# EAGLE design NixiePSU (EAGLE 7.7.0)
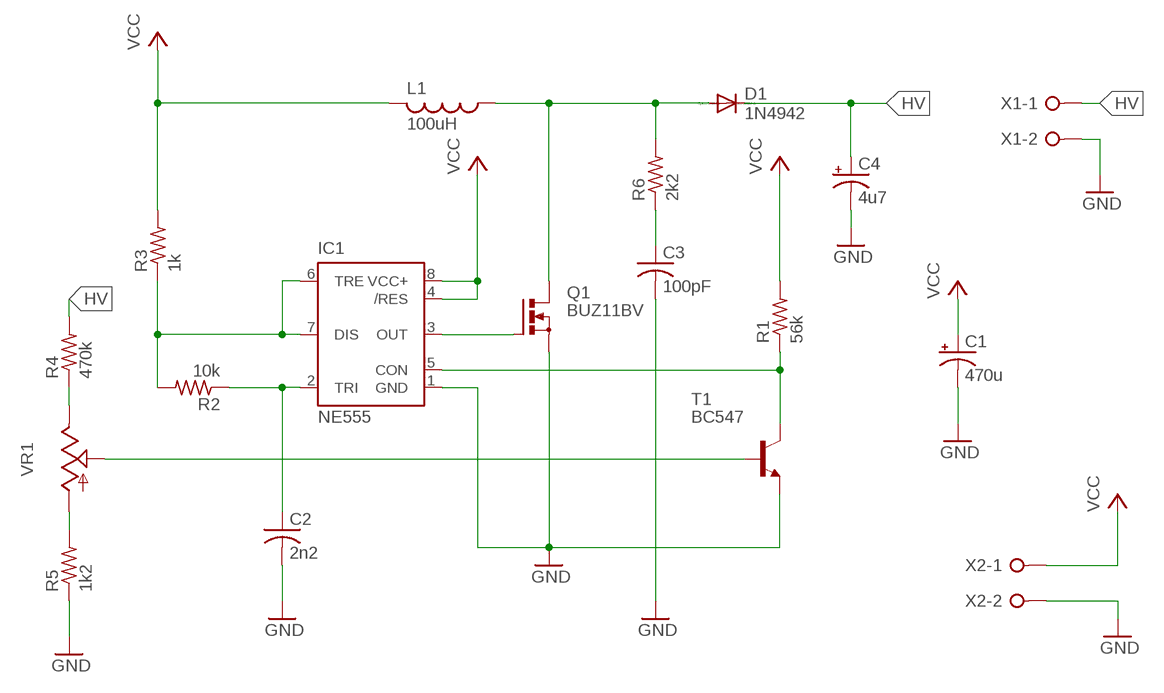
[diagram p0: schematic, sheet 1]

## Parts
C1  470u  CPOL-USE5-13  [E5-13]
C2  2n2  C-US050-025X075  [C050-025X075]
C3  100pF  C-US050-025X075  [C050-025X075]
C4  4u7  CPOL-USE3.5-8  [E3,5-8]
D1  1N4942  [DO41-10]
IC1  NE555  [DIL-08]
L1  100uH  L-US  [RLB0914]
Q1  BUZ11BV  [TO220BV]
R1  56k  R-US_0207/10  [0207/10]
R2  10k  R-US_0207/10  [0207/10]
R3  1k  R-US_0207/10  [0207/10]
R4  470k  R-US_0207/10  [0207/10]
R5  1k2  R-US_0207/10  [0207/10]
R6  2k2  R-US_0207/10  [0207/10]
T1  BC547  [TO92]
VR1  TRIM_US-B25P  [B25P]
X1  W237-02P  [W237-132]
X2  W237-02P  [W237-132]

## Nets
GND: C1.- C2.2 C3.2 C4.- IC1.1(GND) Q1.S R5.1 T1.1(E) X1.2 X2.2
HV: C4.+ D1.C R4.2 X1.1
N$1: IC1.3(OUT) Q1.G
N$2: D1.A L1.1 Q1.D R6.2
N$3: IC1.6(TRE) IC1.7(DIS) R2.2 R3.1
N$4: R4.1 VR1.E
N$6: IC1.5(CON) R1.1 T1.3(C)
N$7: R5.2 VR1.A
N$8: T1.2(B) VR1.S
N$9: C3.1 R6.1
N$10: C2.1 IC1.2(TRI) R2.1
VCC: C1.+ IC1.4(/RES) IC1.8(VCC+) L1.2 R1.2 R3.2 X2.1

## Library data of the parts
C1 C4 = rcl:CPOL-US: POLARIZED CAPACITOR, American symbol
C2 C3 = rcl:C-US: CAPACITOR, American symbol
D1 = diode:1N4942: DIODE 1.0 A, 200 V, 150 ns
IC1 = st-microelectronics:NE555: General purpose bipolar Timer; MF: Arrow Electronics; MPN: NE555N; OC_FARNELL: 1467742; OC_NEWARK: 89K1486
L1 = Inductors:L-US: INDUCTOR, American symbol
Q1 = transistor-power:BUZ11: N-CHANNEL MOS FET
R1-R6 = rcl:R-US_: RESISTOR, American symbol
T1 = transistor:BC547: NPN TRANSISTOR
VR1 = pot:TRIM_US-: POTENTIOMETER
X1 X2 = con-wago-508:W237-02P: WAGO SREW CLAMP; OC_FARNELL: unknown; OC_NEWARK: unknown

## Board
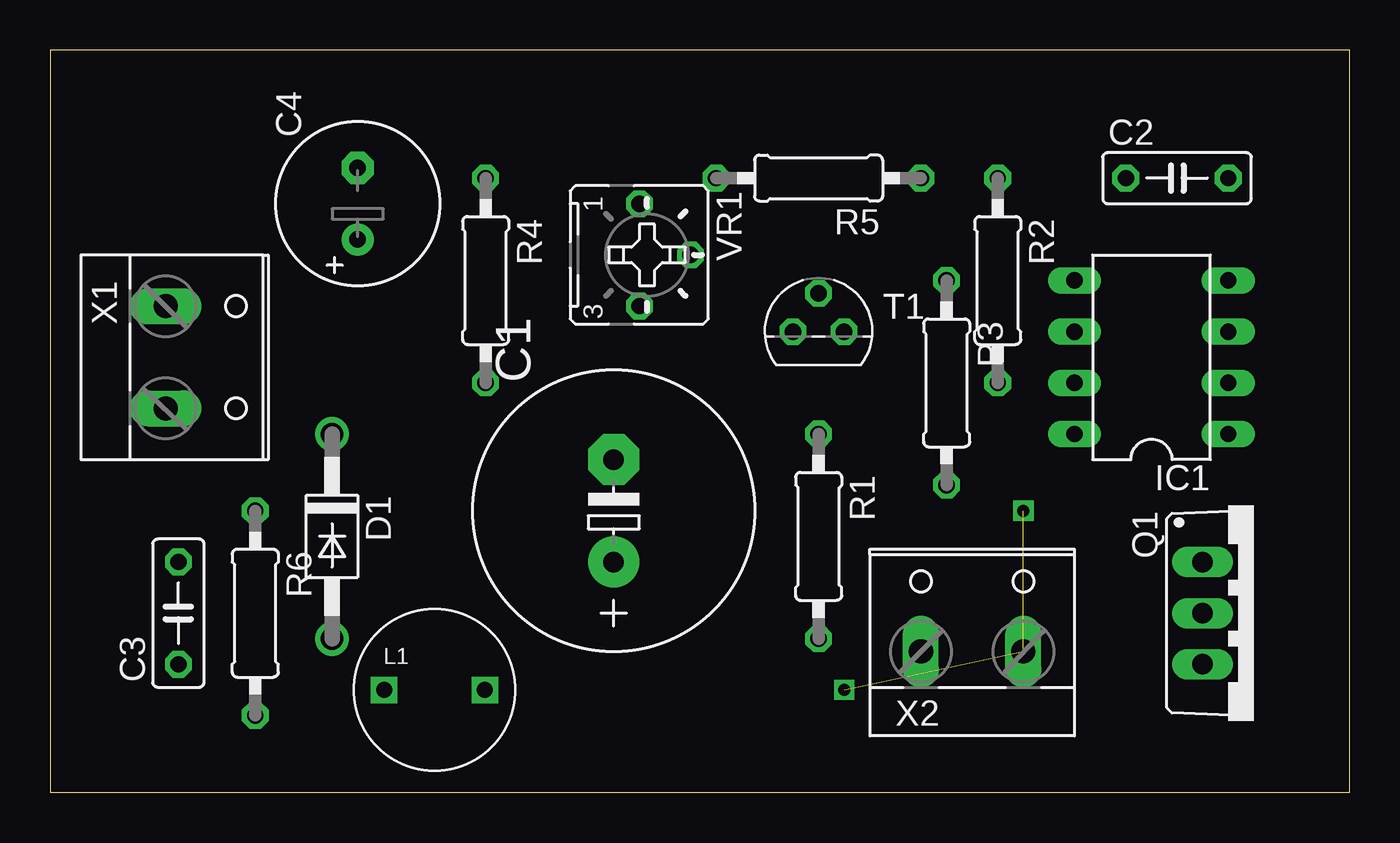
[diagram p1: board, top side]
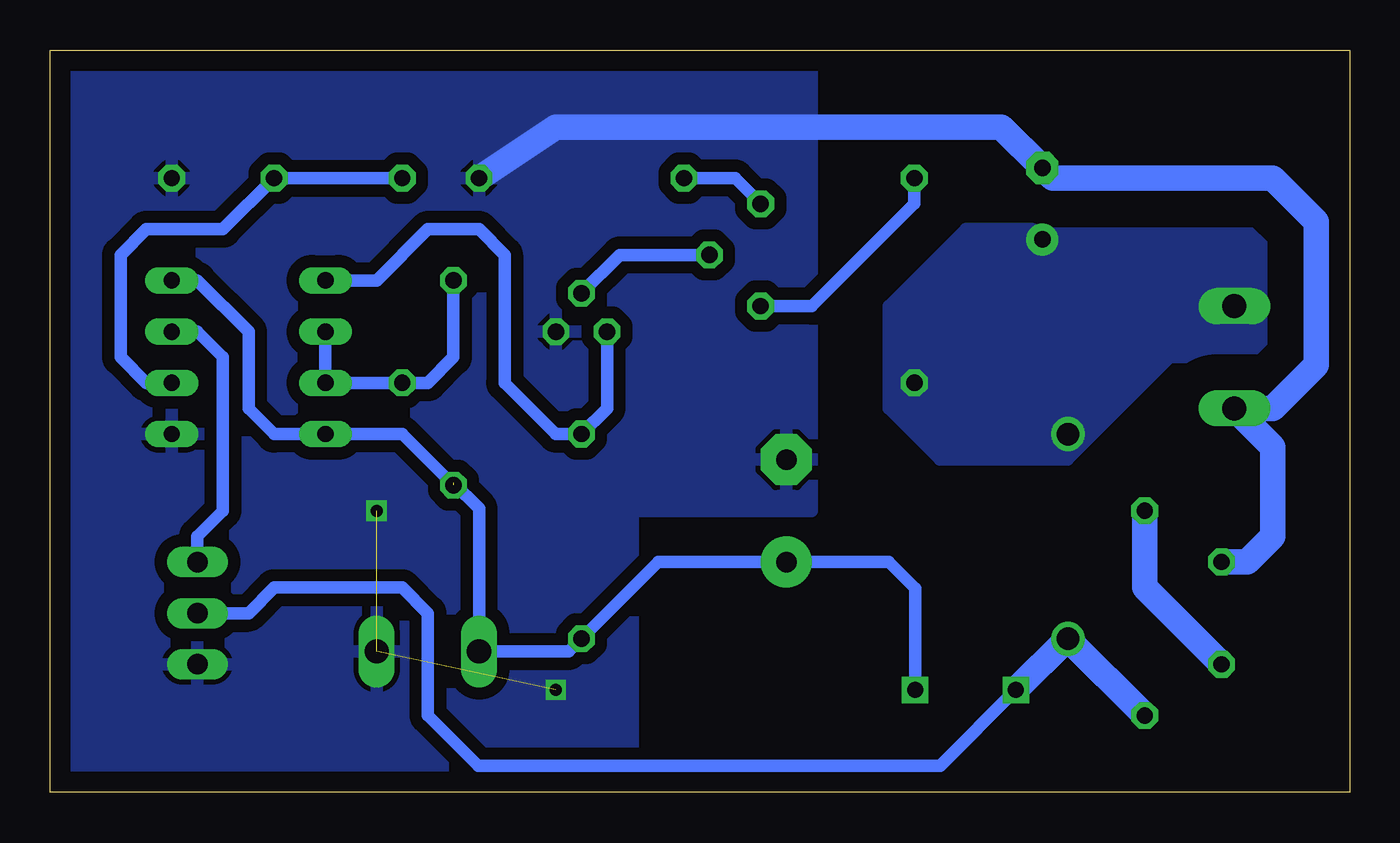
[diagram p2: board, bottom side, seen from below]

Size 64.44 x 36.82 mm. Coordinates in mm from the lower left corner, seen from the top.
Outline: 0,0 64.44,0 64.44,36.82 0,36.82 0,0
Copper layers (1*16): Top 0.035mm / dielectric 1.5mm / Bottom 0.035mm
Design rules "default": minimum track width 10mil, minimum drill 24mil, track to track 8mil, track to pad 8mil, pad to pad 8mil, via to via 8mil, smd to smd 8mil, copper to edge 40mil, drill to drill 8mil, minimum pad ring 10mil, minimum via ring 8mil, stop-mask expansion 4mil, vias tented up to drill 0mil, thermal gap 10mil

### Footprints (pad centres in the part's own frame; a part is rotated, then mirrored left to right if it is on the bottom)
E5-13 = drill 1.016 pad 2.54: + -2.54,0 | drill 1.016 pad 2.54 octagon: - 2.54,0
C050-025X075 = drill 0.813 octagon: 1 -2.54,0; 2 2.54,0
E3,5-8 = drill 0.813 pad 1.6: + -1.778,0 | drill 0.813 pad 1.6 octagon: - 1.778,0
DO41-10 = drill 1.118: A 5.08,0; C -5.08,0
DIL-08 = drill 0.813 long: 1 -3.81,-3.81; 2 -1.27,-3.81; 3 1.27,-3.81; 4 3.81,-3.81; 5 3.81,3.81; 6 1.27,3.81; 7 -1.27,3.81; 8 -3.81,3.81
RLB0914 = drill 0.8 square: 1 -2.5,0; 2 2.5,0
TO220BV = drill 1.016 long: D 0,-2.54; G -2.54,-2.54; S 2.54,-2.54
0207/10 = drill 0.813 octagon: 1 -5.08,0; 2 5.08,0
TO92 = drill 0.813 octagon: 1 1.27,0; 2 0,1.905; 3 -1.27,0
B25P = drill 0.813 octagon: A -2.54,0; E 2.54,0; S 0,2.54
W237-132 = drill 1.194 long: 1 -2.54,-0.635; 2 2.54,-0.635

### Placement (x,y rotation side)
C1  27.94,13.97 90 top
C2  55.88,30.48 0 top
C3  6.35,8.89 90 top
C4  15.24,29.21 90 top
D1  13.97,12.7 270 top
IC1  54.61,21.59 90 top
L1  19.05,5.08 0 top
Q1  59.69,8.89 270 top
R1  38.1,12.7 270 top
R2  46.99,25.4 270 top
R3  44.45,20.32 270 top
R4  21.59,25.4 270 top
R5  38.1,30.48 180 top
R6  10.16,8.89 270 top
T1  38.1,22.86 0 top
VR1  29.21,26.67 270 top
X1  6.35,21.59 270 top
X2  45.72,7.62 0 top

### Tracks (layer width: path | path; a pad name or v marks a point on that pad's centre or on a via)
GND  (via drill 0.6)  (2 unrouted)
  Bottom 1.27: R5.1 39.37,33.02 17.27,33.02 C4.- 14.73,30.48 3.81,30.48 1.65,28.32 1.65,21.21 3.81,19.05 X1.2 3.81,17.14 3.81,12.7 5.08,11.43 C3.2
  other vias: 48.26,13.97 39.37,5.08
  pour Bottom (isolate 0.61): 26.67,39.37 66.04,39.37 66.04,-2.54 35.56,-2.54 35.56,13.97 26.67,13.97
HV
  pour Bottom (isolate 1.778, no thermals): 3.81,21.59 3.81,26.67 5.08,27.94 19.05,27.94 22.86,24.13 22.86,19.05 20.32,16.51 13.97,16.51 8.89,21.59
N$1
  Bottom 0.61: IC1.3 57.15,22.86 55.88,21.59 55.88,13.97 57.15,12.7 Q1.G
N$2
  Bottom 0.61: Q1.D 54.61,8.89 53.34,10.16 46.99,10.16 45.72,8.89 45.72,3.81 43.23,1.32 20.31,1.32 L1.1
  Bottom 1.27: R6.2 D1.A 14.01,7.62 L1.1
N$3
  Bottom 0.61: R3.1 44.45,21.59 45.72,20.32 R2.2 50.72,20.32 | 50.72,20.32 IC1.7 | IC1.6 50.8,20.4 50.72,20.32
N$4
  Bottom 0.61: VR1.E 26.67,24.13 21.59,29.21 R4.1
N$6
  Bottom 0.61: T1.3 36.83,19.05 R1.1 39.37,17.78 41.91,20.32 41.91,26.67 43.18,27.94 45.72,27.94 48.26,25.4 IC1.5
N$7
  Bottom 0.61: VR1.A 30.48,30.48 R5.2
N$8
  Bottom 0.61: VR1.S 36.2,26.67 T1.2
N$9
  Bottom 1.27: R6.1 10.16,10.16 C3.1
N$10
  Bottom 0.61: R2.1 C2.1 55.88,27.94 59.69,27.94 60.96,26.67 60.96,21.59 59.69,20.32 IC1.2
VCC  (1 unrouted)
  Bottom 0.61: 42.55,6.99 X2.1 | X2.1 43.18,14.08 44.45,15.35 | X2.1 38.73,6.99 R1.2 34.29,11.43 C1.+ 22.86,11.43 21.55,10.12 L1.2 | IC1.4 57.15,25.4 54.61,22.86 54.61,19.05 53.34,17.78 IC1.8 46.99,17.78 R3.2